# EAGLE schematic drums_01 (EAGLE 9.0.0)
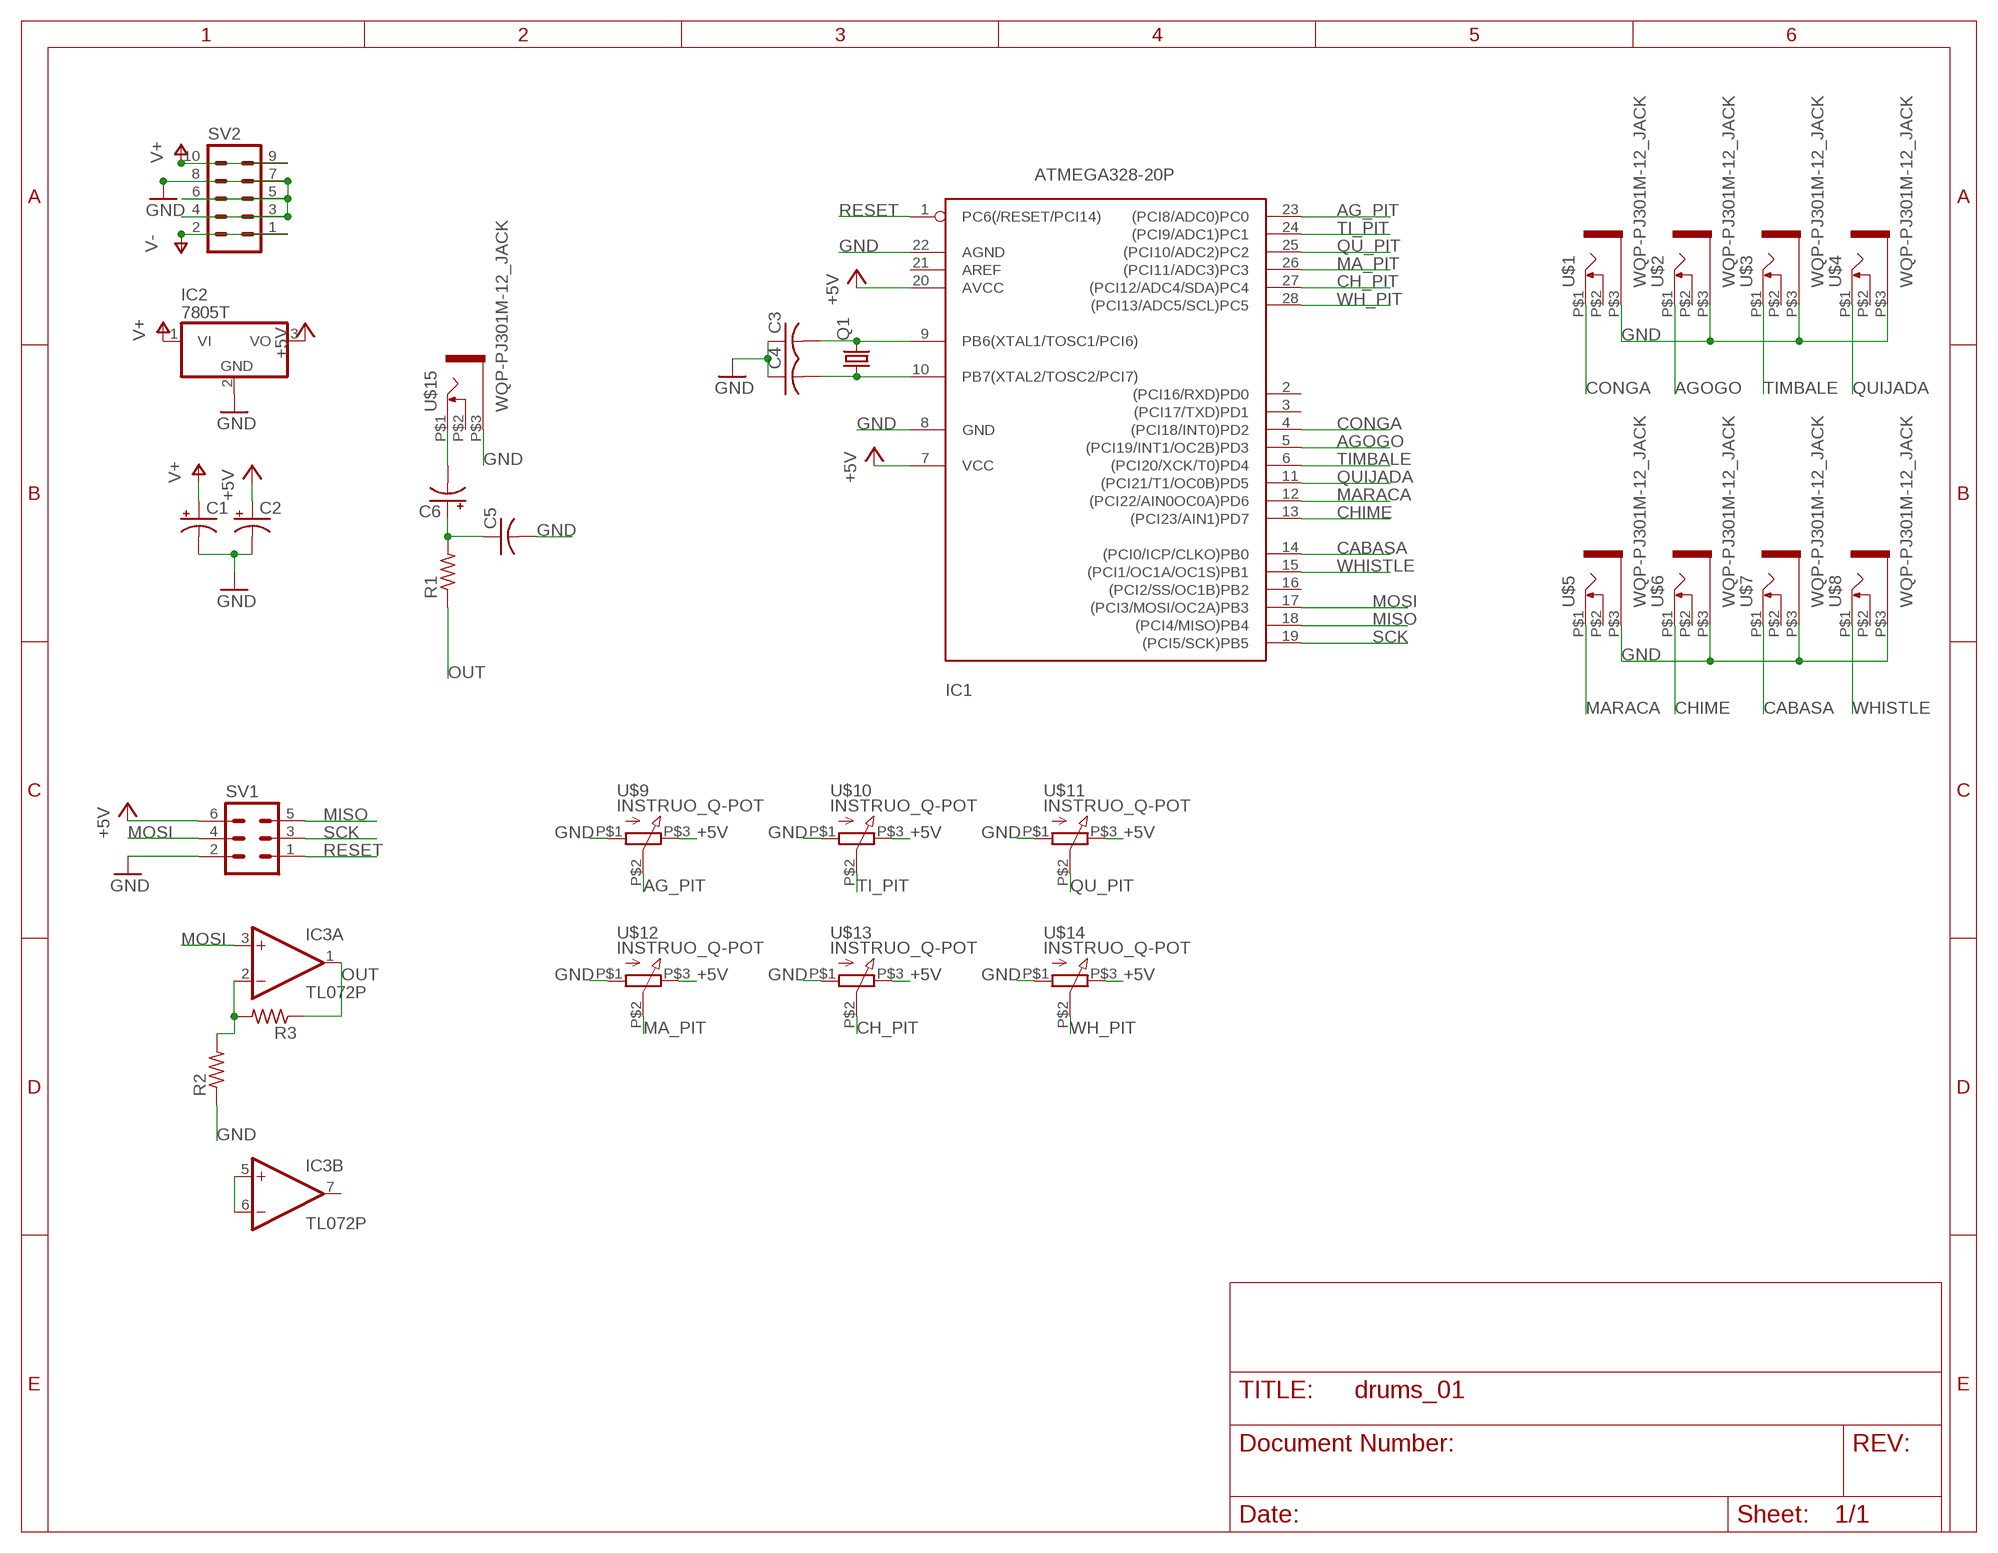
[diagram p0: schematic, sheet 1]

## Parts
C1  CPOL-USE2.5-6  [E2,5-6]
C2  CPOL-USE2.5-6  [E2,5-6]
C3  C-US025-024X044  [C025-024X044]
C4  C-US025-024X044  [C025-024X044]
C5  C-US025-024X044  [C025-024X044]
C6  CPOL-USE2.5-6  [E2,5-6]
IC1  ATMEGA328-20P  [DIL28-3]
IC2  7805T  [TO220H]
IC3  TL072P  [DIL08]
Q1  CRYSTALHC49U-V  [HC49U-V]
R1  R-US_0207/12  [0207/12]
R2  R-US_0207/12  [0207/12]
R3  R-US_0207/12  [0207/12]
SV1  MA03-2  [MA03-2]
SV2  MA05-2  [MA05-2]
U$1  WQP-PJ301M-12_JACK  [WQP-PJ301M-12_JACK]
U$2  WQP-PJ301M-12_JACK  [WQP-PJ301M-12_JACK]
U$3  WQP-PJ301M-12_JACK  [WQP-PJ301M-12_JACK]
U$4  WQP-PJ301M-12_JACK  [WQP-PJ301M-12_JACK]
U$5  WQP-PJ301M-12_JACK  [WQP-PJ301M-12_JACK]
U$6  WQP-PJ301M-12_JACK  [WQP-PJ301M-12_JACK]
U$7  WQP-PJ301M-12_JACK  [WQP-PJ301M-12_JACK]
U$8  WQP-PJ301M-12_JACK  [WQP-PJ301M-12_JACK]
U$9  INSTRUO_Q-POT  [INSTRUO_Q-POT]
U$10  INSTRUO_Q-POT  [INSTRUO_Q-POT]
U$11  INSTRUO_Q-POT  [INSTRUO_Q-POT]
U$12  INSTRUO_Q-POT  [INSTRUO_Q-POT]
U$13  INSTRUO_Q-POT  [INSTRUO_Q-POT]
U$14  INSTRUO_Q-POT  [INSTRUO_Q-POT]
U$15  WQP-PJ301M-12_JACK  [WQP-PJ301M-12_JACK]

## Nets
+5V: C2.+ IC1.7(VCC) IC1.20(AVCC) IC2.3(VO) SV1.6 U$9.P$3 U$10.P$3 U$11.P$3 U$12.P$3 U$13.P$3 U$14.P$3
AG_PIT: IC1.23((PCI8/ADC0)PC0) U$9.P$2
AGOGO: IC1.5((PCI19/INT1/OC2B)PD3) U$2.P$1
CABASA: IC1.14((PCI0/ICP/CLKO)PB0) U$7.P$1
CH_PIT: IC1.27((PCI12/ADC4/SDA)PC4) U$13.P$2
CHIME: IC1.13((PCI23/AIN1)PD7) U$6.P$1
CONGA: IC1.4((PCI18/INT0)PD2) U$1.P$1
GND: C1.- C2.- C3.1 C4.1 C5.2 IC1.8(GND) IC1.22(AGND) IC2.2(GND) R2.1 SV1.2 SV2.3 SV2.4 SV2.5 SV2.6 SV2.7 SV2.8 U$1.P$3 U$2.P$3 U$3.P$3 U$4.P$3 U$5.P$3 U$6.P$3 U$7.P$3 U$8.P$3 U$9.P$1 U$10.P$1 U$11.P$1 U$12.P$1 U$13.P$1 U$14.P$1 U$15.P$3
MA_PIT: IC1.26((PCI11/ADC3)PC3) U$12.P$2
MARACA: IC1.12((PCI22/AIN0OC0A)PD6) U$5.P$1
MISO: IC1.18((PCI4/MISO)PB4) SV1.5
MOSI: IC1.17((PCI3/MOSI/OC2A)PB3) IC3.3(A:+IN) SV1.4
N$1: C3.2 IC1.9(PB6(XTAL1/TOSC1/PCI6)) Q1.2
N$2: C4.2 IC1.10(PB7(XTAL2/TOSC2/PCI7)) Q1.1
N$3: C6.- U$15.P$1
N$4: C5.1 C6.+ R1.2
N$5: IC3.5(B:+IN) IC3.6(B:-IN)
N$7: IC3.2(A:-IN) R2.2 R3.2
OUT: IC3.1(A:OUT) R1.1 R3.1
QU_PIT: IC1.25((PCI10/ADC2)PC2) U$11.P$2
QUIJADA: IC1.11((PCI21/T1/OC0B)PD5) U$4.P$1
RESET: IC1.1(PC6(/RESET/PCI14)) SV1.1
SCK: IC1.19((PCI5/SCK)PB5) SV1.3
TI_PIT: IC1.24((PCI9/ADC1)PC1) U$10.P$2
TIMBALE: IC1.6((PCI20/XCK/T0)PD4) U$3.P$1
V+: C1.+ IC2.1(VI) SV2.9 SV2.10
V-: SV2.1 SV2.2
WH_PIT: IC1.28((PCI13/ADC5/SCL)PC5) U$14.P$2
WHISTLE: IC1.15((PCI1/OC1A/OC1S)PB1) U$8.P$1
Unconnected: IC1.2((PCI16/RXD)PD0) IC1.3((PCI17/TXD)PD1) IC1.16((PCI2/SS/OC1B)PB2) IC1.21(AREF) IC3.7(B:OUT) U$1.P$2 U$2.P$2 U$3.P$2 U$4.P$2 U$5.P$2 U$6.P$2 U$7.P$2 U$8.P$2 U$15.P$2

## Power pins joined to a net without a drawn wire
V+: IC3.8(P:V+)
V-: IC3.4(P:V-)

## Library data of the parts
C1 C2 C6 = rcl:CPOL-US: POLARIZED CAPACITOR, American symbol; SPICEPREFIX: C
C3-C5 = rcl:C-US: CAPACITOR, American symbol; SPICEPREFIX: C
IC1 = atmega328:ATMEGA328*P: MICROCONTROLLER 32 kBytes FLASH 2 kBytes SRAM 1 kBytes EEPROM USART 8-channel 10 bit ADC
IC2 = linear:78*: Positive VOLTAGE REGULATOR Source: http://cache.national.com/ds/LM/LM78L05.pdf http://www.fairchildsemi.com/ds/LM/LM7805.pdf
IC3 = linear:TL072: OP AMP
Q1 = crystal:CRYSTAL: CRYSTAL; OC_FARNELL: 1666969; OC_NEWARK: unknown
R1-R3 = rcl:R-US_: RESISTOR, American symbol; SPICEPREFIX: R
SV1 = con-lstb:MA03-2: PIN HEADER; OC_FARNELL: unknown; OC_NEWARK: unknown
SV2 = con-lstb:MA05-2: PIN HEADER; OC_FARNELL: unknown; OC_NEWARK: unknown
U$1-U$8 U$15 = thonkiconn:WQP-PJ301M-12_JACK
U$9-U$14 = Pure_VCO_SMD_V2_2:INSTRUO_Q-POT